# Altium schematic sheet [01] - PWR 0V9, PWR SEQ.SchDoc
size A4; DocumentNumber: 1; SheetNumber: 1; SheetTotal: 15
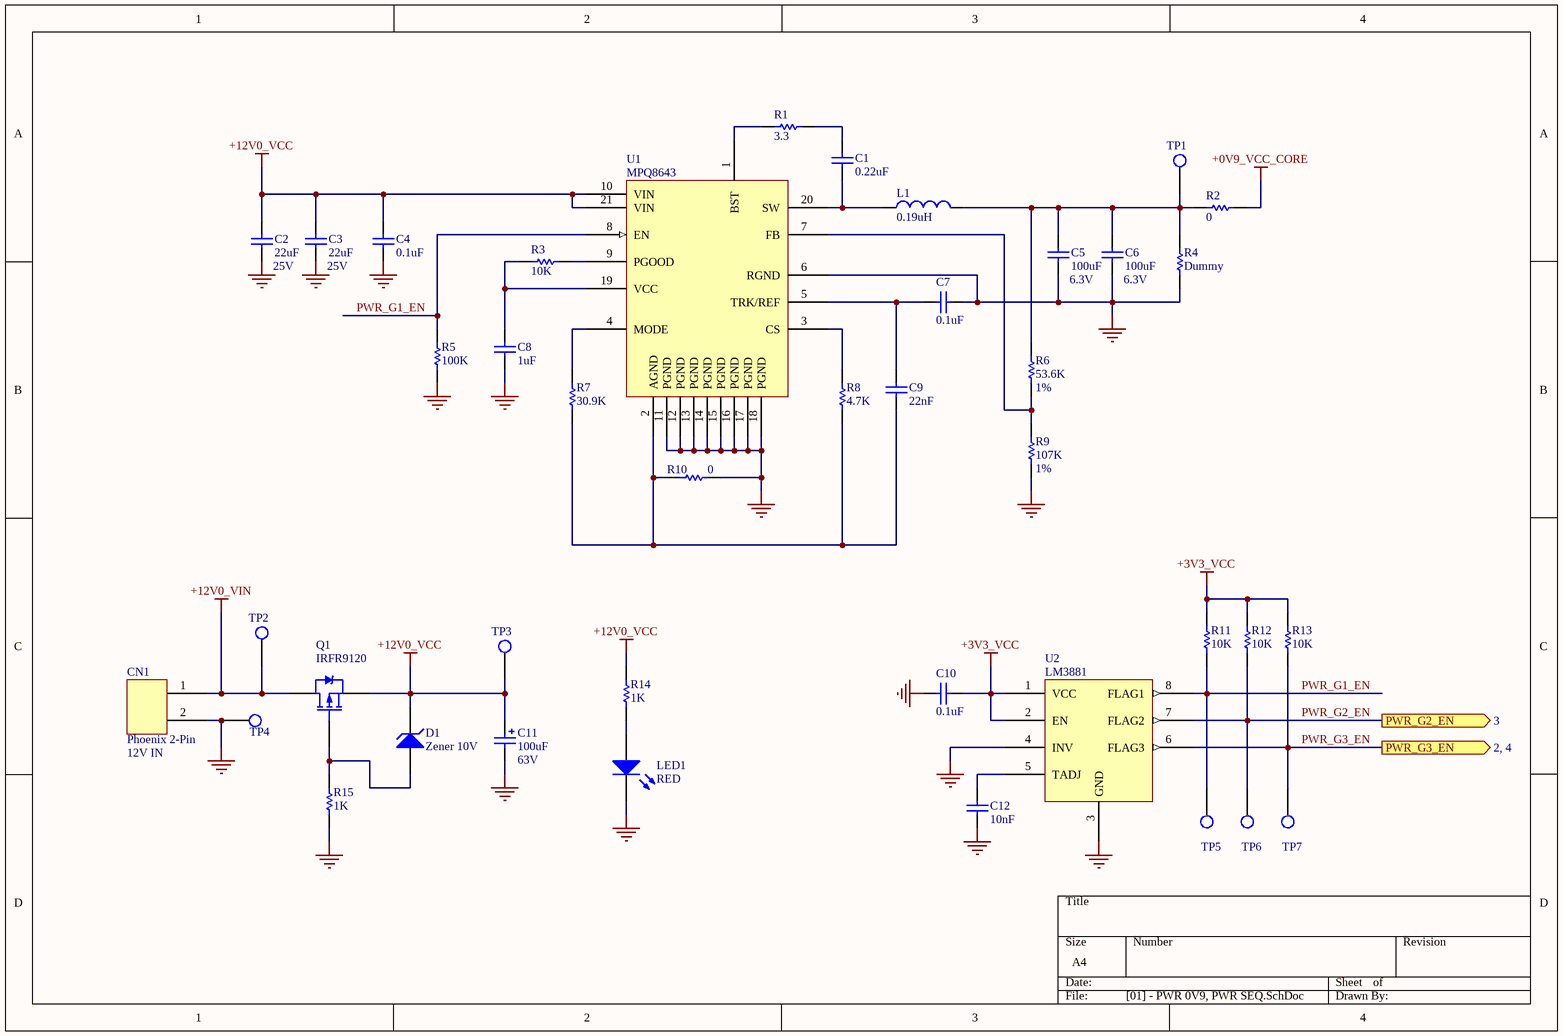
[diagram p0: [01] - PWR 0V9, PWR SEQ.SchDoc]

## Parts
C1  0.22uF  [0402_C]
C2  22uF  RATED_VOLTAGE: 25V  [1210_C]
C3  22uF  RATED_VOLTAGE: 25V  [1210_C]
C4  0.1uF  [0402_C]
C5  100uF  RATED_VOLTAGE: 6.3V  [1210_C]
C6  100uF  RATED_VOLTAGE: 6.3V  [1210_C]
C7  0.1uF  [0402_C]
C8  1uF  [0402_C]
C9  22nF  [0402_C]
C10  0.1uF  [0402_C]
C11  100uF  RATED_VOLTAGE: 63V  [G_PANASONIC]
C12  10nF  [0402_C]
CN1  Phoenix 2-Pin  [PHOENIX_2PIN_RIGHT_200mil]
D1  Zener 10V  [SOD-123]
L1  0.19uH  [IHLP-4040]
LED1  RED  [LED_0805]
Q1  IRFR9120  [TO-252]
R1  3.3  [0402_R]
R2  0  [1210_R]
R3  10K  [0402_R]
R4  Dummy  [1210_R]
R5  100K  [0402_R]
R6  53.6K  Tolerance: 1%  [0402_R]
R7  30.9K  [0402_R]
R8  4.7K  [0402_R]
R9  107K  Tolerance: 1%  [0402_R]
R10  0  [0402_R]
R11  10K  [0402_R]
R12  10K  [0402_R]
R13  10K  [0402_R]
R14  1K  [0805_R]
R15  1K  [0805_R]
TP1  Test Point  [PIN_1.5mm]  (value not drawn)
TP2  Test Point  [PIN_1.5mm]  (value not drawn)
TP3  Test Point  [PIN_1.5mm]  (value not drawn)
TP4  Test Point  [PIN_1.5mm]  (value not drawn)
TP5  Test Point  [PIN_1mm]  (value not drawn)
TP6  Test Point  [PIN_1mm]  (value not drawn)
TP7  Test Point  [PIN_1mm]  (value not drawn)
U1  MPQ8643
U2  LM3881

## Ports
PWR_G2_EN (out, see 3), PWR_G3_EN (out, see 2, 4)

## Nets
+0V9_VCC_CORE: R2.2
+3V3_VCC: C10.1 R11.2 R12.2 R13.2 U2.1(VCC) U2.2(EN)
+12V0_VCC: C2.2 C3.2 C4.2 C11.1 D1.2(K) Q1.2(S) R14.2 TP3.1 U1.10(VIN) U1.21(VIN)
+12V0_VIN: CN1.1 Q1.3(D) TP2.1
GND: C2.1 C3.1 C4.1 C5.1 C6.1 C7.1 C8.1 C10.2 C11.2 C12.2 CN1.2 LED1.2(K) R4.1 R5.2 R9.1 R10.2 R15.1 TP4.1 U1.6(RGND) U1.11(PGND) U1.12(PGND) U1.13(PGND) U1.14(PGND) U1.15(PGND) U1.16(PGND) U1.17(PGND) U1.18(PGND) U2.3(GND) U2.4(INV)
PWR_G1_EN: R5.1 R11.1 TP5.1 U1.8(EN) U2.8(FLAG1)
PWR_G2_EN: R12.1 TP6.1 U2.7(FLAG2) ; port PWR_G2_EN
PWR_G3_EN: R13.1 TP7.1 U2.6(FLAG3) ; port PWR_G3_EN
NetC1_1: C1.1 L1.1 U1.20(SW)
NetC1_2: C1.2 R1.2
NetC5_2: C5.2 C6.2 L1.2 R2.1 R4.2 R6.2 TP1.1
NetC7_2: C7.2 C9.2 U1.5(TRK/REF)
NetC8_2: C8.2 R3.2 U1.19(VCC)
NetC9_1: C9.1 R7.1 R8.1 R10.1 U1.2(AGND)
NetC12_1: C12.1 U2.5(TADJ)
NetD1_1: D1.1(A) Q1.1(G) R15.2
NetLED1_1: LED1.1(A) R14.1
NetR1_1: R1.1 U1.1(BST)
NetR3_1: R3.1 U1.9(PGOOD)
NetR6_1: R6.1 R9.2 U1.7(FB)
NetR7_2: R7.2 U1.4(MODE)
NetR8_2: R8.2 U1.3(CS)

## Notes on the sheet
- (near CN1) 12V IN

## Library data of the parts
C1 = Cap SMD: Non-Pol SMD Capacitor; RATED_VOLTAGE: 25V; Value: 0.22uF; Manufacturer Part Num: *; Dielectric: *
C2 C3 = Cap SMD: Non-Pol SMD Capacitor; Manufacturer Part Num: GRM32ER71E226KE15; Dielectric: X7R; Value: 22uF
C4 C7-C10 C12 = Cap SMD: Non-Pol SMD Capacitor; RATED_VOLTAGE: 16V; Manufacturer Part Num: *; Dielectric: *
  C4 C7 C10: Value: 0.1uF
  C8: Value: 1uF
  C9: Value: 22nF
  C12: Value: 10nF
C5 C6 = Cap SMD: Non-Pol SMD Capacitor; Manufacturer Part Num: GRM32EC70J107ME15; Dielectric: X7S; Value: 100uF
C11 = Cap Aluminium Electrolytic: Aluminium Electrolytic Capacitor; Manufacturer Part Num: EEE-TG1J101UP; Value: 100uF
CN1 = Phoenix 2 pin: 2-Pin Phoenix Terminal; Value: Phoenix 2-Pin
D1 = Diode Zener: Zener Diode; Manufacturer Part Num: BZT52C10-7-F; Value: Zener 10V
L1 = Inductor: Inductor SMD; Manufacturer Part Num: IHLP4040DZERR19M11; Value: 0.19uH
LED1 = LED: Typical LED; Value: RED
Q1 = MOSFET P-CH: P-Channel Mosfet; Manufacturer Part Num: IRFR9120PBF; Value: IRFR9120
R1-R5 R7 R8 R10-R15 = Res SMD: SMD Resistor; Tolerance: 5%; Manufacturer Part Num: *
  R1: Value: 3.3
  R2 R10: Value: 0
  R3 R11-R13: Value: 10K
  R4: Value: Dummy
  R5: Value: 100K
  R7: Value: 30.9K
  R8: Value: 4.7K
  R14 R15: Value: 1K
R6 R9 = Res SMD: SMD Resistor; Manufacturer Part Num: *
  R6: Value: 53.6K
  R9: Value: 107K
TP1-TP7 = Test Point: Test Point Footprint; Value: Test Point
U1 = MPQ8643: 16V, 20A, Configurable-Frequency, Synchronous Step-Down Converter; Manufacturer Part Num: MPQ8643GLE-P; Value: MPQ8643
U2 = LM3881: Simple Power Sequencer With Adjustable Timing; Value: LM3881; Manufacturer Part Num: *